# Altium schematic sheet CHARGER.SchDoc
size 420 x 297 mm; SheetNumber: 18; SheetTotal: 20
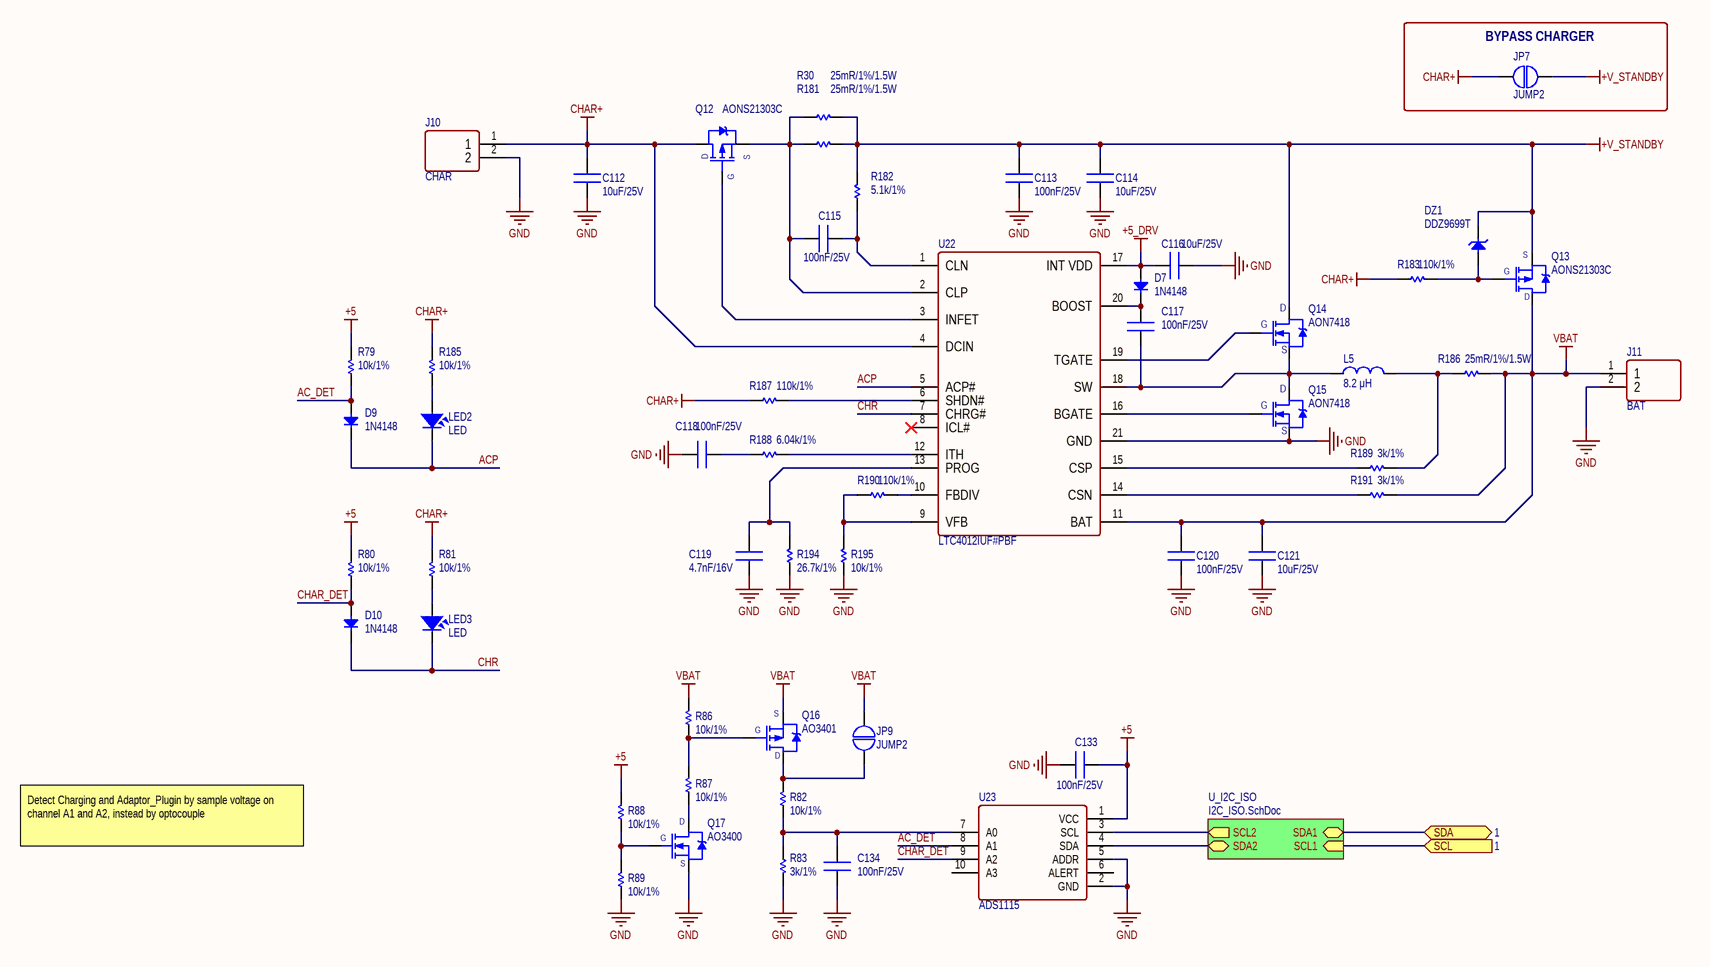
[diagram p0: CHARGER.SchDoc]

## Parts
C112  10uF/25V  [CN-SMD-0603]
C113  100nF/25V  [CN-SMD-0603]
C114  10uF/25V  [CN-SMD-0603]
C115  100nF/25V  [CN-SMD-0603]
C116  10uF/25V  [CN-SMD-0603]
C117  100nF/25V  [CN-SMD-0603]
C118  100nF/25V  [CN-SMD-0603]
C119  4.7nF/16V  [CN-SMD-0603]
C120  100nF/25V  [CN-SMD-0603]
C121  10uF/25V  [CN-SMD-0603]
C133  100nF/25V  [CN-SMD-0603]
C134  100nF/25V  [CN-SMD-0603]
D7  1N4148  [DIO-SMD-323]
D9  1N4148  [DIO-SMD-323]
D10  1N4148  [DIO-SMD-323]
DZ1  DDZ9699T  [DIO-SMD-523]
J10  CHAR  [S2P-VH(LF)(SN)]
J11  BAT  [S2P-VH(LF)(SN)]
JP7  JUMP2  [JUMPER_2012]  (no BOM)
JP9  JUMP2  [JUMPER_2012]  (no BOM)
L5  8.2 μH  [PSM1040]
LED2  LED  [LED-0603-RED]
LED3  LED  [LED-0603-RED]
Q12  AONS21303C  [PowerPAK SO-8 Single]
Q13  AONS21303C  [PowerPAK SO-8 Single]
Q14  AON7418  [DFN3.3x3.3_8L]
Q15  AON7418  [DFN3.3x3.3_8L]
Q16  AO3401  [SOT23-123]
Q17  AO3400  [SOT23-123]
R30  25mR/1%/1.5W  [RES-SMD-1206]
R79  10k/1%  [RES-SMD-0603]
R80  10k/1%  [RES-SMD-0603]
R81  10k/1%  [RES-SMD-0603]
R82  10k/1%  [RES-SMD-0603]
R83  3k/1%  [RES-SMD-0603]
R86  10k/1%  [RES-SMD-0603]
R87  10k/1%  [RES-SMD-0603]
R88  10k/1%  [RES-SMD-0603]
R89  10k/1%  [RES-SMD-0603]
R181  25mR/1%/1.5W  [RES-SMD-1206]
R182  5.1k/1%  [RES-SMD-0603]
R183  110k/1%  [RES-SMD-0603]
R185  10k/1%  [RES-SMD-0603]
R186  25mR/1%/1.5W  [RES-SMD-1206]
R187  110k/1%  [RES-SMD-0603]
R188  6.04k/1%  [RES-SMD-0603]
R189  3k/1%  [RES-SMD-0603]
R190  110k/1%  [RES-SMD-0603]
R191  3k/1%  [RES-SMD-0603]
R194  26.7k/1%  [RES-SMD-0603]
R195  10k/1%  [RES-SMD-0603]
U22  LTC4012IUF#PBF  [PQFN50P400X400X80_HS-21N]
U23  ADS1115  [R-PQFP-N10]

## Blocks framed on the sheet
BYPASS CHARGER: JP7

## Sub-sheets
U_I2C_ISO = I2C_ISO.SchDoc: SDA1 (bidir), SCL1 (in), SDA2 (bidir), SCL2 (out)

## Ports
SCL (in, see 1), SDA (bidir, see 1)

## Nets
+5: C133.2 R79.2 R80.2 R88.2 U23.1(VCC)
+5_DRV: C116.1 D7.1(A) U22.17(INT_VDD)
+V_STANDBY: C113.1 C114.1 DZ1.2(K) JP7.2 Q13.1,2,3(S) Q14.5,6,7,8,9(D) R30.2 R181.2 R182.2
CHAR+: C112.1 J10.1 JP7.1 Q12.5(D) R81.2 R183.1 R185.2 R187.1 U22.4(DCIN)
GND: C112.2 C113.2 C114.2 C116.2 C118.2 C119.2 C120.2 C121.2 C133.1 C134.2 J10.2 J11.2 Q15.1,2,3(S) Q17.3(S) R83.2 R89.1 R194.1 R195.1 U22.21(GND) U23.2(GND) U23.5(ADDR)
VBAT: C120.1 C121.1 J11.1 JP9.2 Q13.5(D) Q16.3(S) R86.2 R186.2 R191.2 U22.11(BAT)
AC_DET: D9.1(A) R79.1 U23.8(A1)
ACP: D9.2(K) LED2.2 U22.5(ACP#)
CHAR_DET: D10.1(A) R80.1 U23.9(A2)
CHR: D10.2(K) LED3.2 U22.7(CHRG#)
SCL: port SCL, sheet U_I2C_ISO/SCL1
SDA: port SDA, sheet U_I2C_ISO/SDA1
NetC115_1: C115.1 R182.1 U22.1(CLN)
NetC115_2: C115.2 Q12.1,2,3(S) R30.1 R181.1 U22.2(CLP)
NetC117_1: C117.1 L5.1 Q14.1,2,3(S) Q15.5,6,7,8,9(D) U22.18(SW)
NetC117_2: C117.2 D7.2(K) U22.20(BOOST)
NetC118_1: C118.1 R188.1
NetC119_1: C119.1 R194.2 U22.13(PROG)
NetC134_1: C134.1 R82.1 R83.1 U23.7(A0)
NetDZ1_1: DZ1.1(A) Q13.4(G) R183.2
NetJP9_1: JP9.1 Q16.2(D) R82.2
NetL5_2: L5.2 R186.1 R189.2
NetLED2_1: LED2.1 R185.1
NetLED3_1: LED3.1 R81.1
NetQ12_4: Q12.4(G) U22.3(INFET)
NetQ14_4: Q14.4(G) U22.19(TGATE)
NetQ15_4: Q15.4(G) U22.16(BGATE)
NetQ16_1: Q16.1(G) R86.1 R87.2
NetQ17_1: Q17.1(G) R88.1 R89.2
NetQ17_2: Q17.2(D) R87.1
NetR187_2: R187.2 U22.6(SHDN#)
NetR188_2: R188.2 U22.12(ITH)
NetR189_1: R189.1 U22.15(CSP)
NetR190_1: R190.1 R195.2 U22.9(VFB)
NetR190_2: R190.2 U22.10(FBDIV)
NetR191_1: R191.1 U22.14(CSN)
NetU23_3: U23.3(SCL) ; sheet U_I2C_ISO/SCL2
NetU23_4: U23.4(SDA) ; sheet U_I2C_ISO/SDA2

Not connected (* = marked no-connect by the designer): U22 8(ICL#)*; U23 6(ALERT) 10(A3)

## Notes on the sheet
- Detect Charging and Adaptor_Plugin by sample voltage on channel A1 and A2, instead by optocouple
- Project:
- Sub-system:
- Design by:
- Sheet title:
- Sheet
- of
- Checked by:
- Approved by:
- Document No:
- Revision:
- Size:
- Date:

## Library data of the parts
C112 C114 C116 C121 = CN: CAP CER 10UF 25V X5R 0603; PN: CL10A106MA8NRNC
C113 C115 C117 C118 C120 C133 C134 = CN: CAP CER 0.1UF 25V X7R 0603; PN: CL10B104KA8NNNC
C119 = CN: 4700 pF ±10% 16V Ceramic Capacitor X7R 0603 (1608 Metric); PN: C0603C472K4RECAUTO
D7 D9 D10 = Diode SMD: DIODE STANDARD 100V 150MA SOD323; Code - JEDEC: DO-214-AB; PN: 1N4148WX-TP; Published: 8-Jun-2000; Revision: July-2002: Re-released for DXP Platform.; Publisher: Altium Limited
DZ1 = DIODE Zener: DIODE ZENER 12V 150MW SOD523; PN: DDZ9699T-7
J10 J11 = KF2: CONN HEADER R/A 2POS 3.96MM; PN: S2P-VH; ComponentLink1 Description: Manufacturer; ComponentLink2 Description: Datasheet; ComponentLink1URL: http://www.we-online.com; ComponentLink2URL: http://katalog.we-online.de/em/datasheet/6911031100xx.pdf
L5 = L-SMD-1: FIXED IND 8.2UH 8A 24 MOHM SMD; Manufacturer: Wurth Elektronik; PN: SRP1038A-8R2M; Inductance: 8.2 μH; ComponentLink1Description: Manufacturer; ComponentLink1URL: http://www.we-online.de; Created by: Baojun Chen; Created Date: Nov.2015; ComponentLink2Description: Datasheet; ComponentLink2URL: http://katalog.we-online.de/pbs/datasheet/78477010.pdf
LED2 LED3 = LED SMD: LED RED CLEAR 0603 SMD; PN: 150060RS75000
Q12 Q13 = AONS21303C: MOSFET P-CH 30V 180A 8DFN; PN: AONS21303C
Q14 Q15 = AON7292: MOSFET N-CH 30V 46A/50A 8DFN; PN: AON7418
Q16 = AO3401: P-MOS 30V 4A
Q17 = AO3400: MOSFET N-CH 30V 5.7A SOT23-3L; PN: AO3400
R30 R181 R186 = Res-SMD: RESISTOR - ISA-PLAN SHUNT, 0.025; Manufacturer: Generic Components; PN: VMK-R025-1.0-U; Class: Passive; Publisher: Altium Hobart Technology Centre
R79-R82 R86-R89 R185 R195 = Res-SMD: RES SMD 10K OHM 1% 1/10W 0603; Manufacturer: Generic Components; PN: ERJ-3EKF1002V; Class: Passive; Publisher: Altium Hobart Technology Centre
R83 R189 R191 = Res-SMD: RES SMD 3K OHM 0.1% 1/10W 0603; Manufacturer: Generic Components; PN: ERA-3AEB302V; Class: Passive; Publisher: Altium Hobart Technology Centre
R182 = Res-SMD: RES SMD 5.1K OHM 1% 1/10W 0603; Manufacturer: Generic Components; PN: ERJ-3EKF5101V; Class: Passive; Publisher: Altium Hobart Technology Centre
R183 R187 R190 = Res-SMD: RES 110K OHM 1% 1/10W 0603; Manufacturer: Generic Components; PN: RC0603FR-07110KL; Class: Passive; Publisher: Altium Hobart Technology Centre
R188 = Res-SMD: RES 6.04K OHM 1% 1/10W 0603; Manufacturer: Generic Components; PN: RC0603FR-076K04L; Class: Passive; Publisher: Altium Hobart Technology Centre
R194 = Res-SMD: RES 26.7K OHM 1% 1/10W 0603; Manufacturer: Generic Components; PN: RMCF0603FT26K7; Class: Passive; Publisher: Altium Hobart Technology Centre
U22 = LTC4012: IC BAT CHG MULT-CHEM 1-4CL 20QFN; PN: LTC4012IUF#PBF
U23 = ADS1115: IC ADC 16BIT SIGMA-DELTA 10X2QFN; pin to pad: 1>8 2>3 3>10 4>9 5>1 6>2 7>4 8>5 9>6 10>7; PN: ADS1115IRUGR